# Altium project Layer 1 LW SEN.PrjPcb
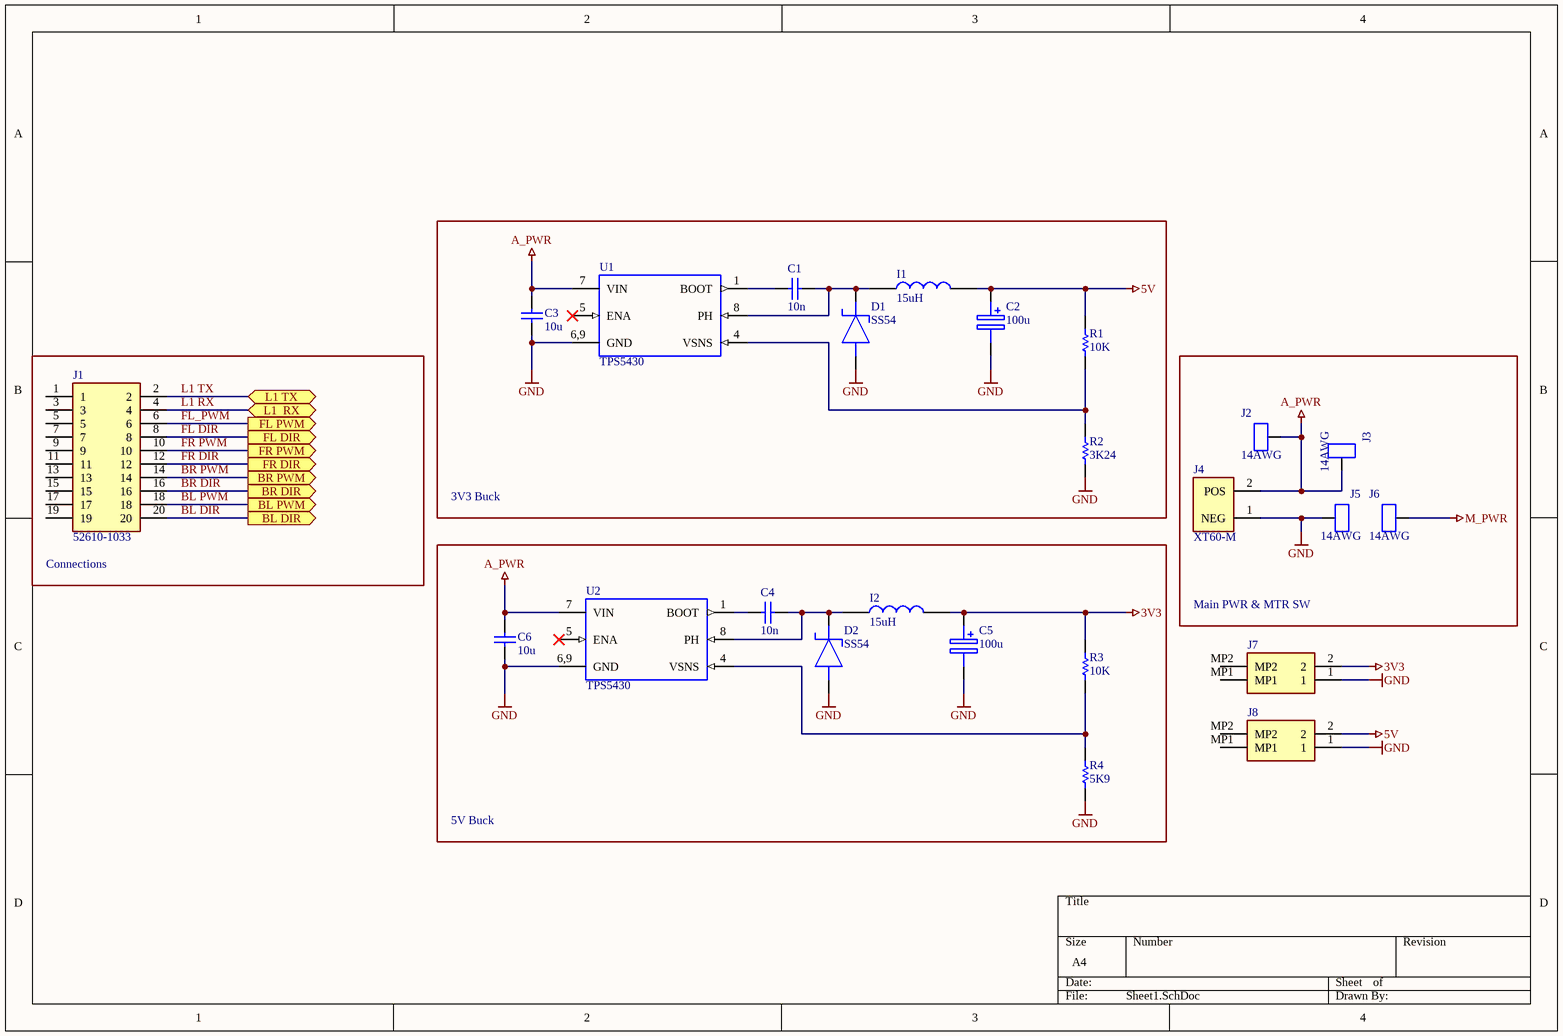
[diagram p0: Sheet1.SchDoc]
3 sheets, 144 parts. Net scope: flat (ports and power ports of the same name join across sheets).
Board file: Sheet1.PcbDoc
Sheets:
  Sheet1.SchDoc
  stm32.SchDoc
  mdriver.SchDoc

## Sheet Sheet1.SchDoc
size A4; SheetNumber: 1; SheetTotal: 4

### Parts
C1  10n  [CAP0603]
C2  100u  [CAP7343]
C3  10u  [CAP0603]
C4  10n  [CAP0603]
C5  100u  [CAP7343]
C6  10u  [CAP0603]
D1  SS54  [SMDSC]
D2  SS54  [SMDSC]
I1  15uH  [SWPA8040]
I2  15uH  [SWPA8040]
J1  52610-1033  [526101033]
J2  14AWG  [14AWG]
J3  14AWG  [14AWG]
J4  XT60-M  [AMASS_XT60-M]
J5  14AWG  [14AWG]
J6  14AWG  [14AWG]
J7  BM02B-SRSS-TB_LF__SN_  [BM02BSRSSTBLFSN]  (value not drawn)
J8  BM02B-SRSS-TB_LF__SN_  [BM02BSRSSTBLFSN]  (value not drawn)
R1  10K  [RES0603]
R2  3K24  [RES0603]
R3  10K  [RES0603]
R4  5K9  [RES0603]
U1  TPS5430  [FP-DDA0008J-MFG]
U2  TPS5430  [FP-DDA0008J-MFG]

### Blocks framed on the sheet
3V3 Buck: C1-C3 D1 I1 R1 R2 U1
Connections: J1
Main PWR & MTR SW: J2-J6
5V Buck: C4-C6 D2 I2 R3 R4 U2

### Ports
BL DIR (out), BL PWM (out), BR DIR (out), BR PWM (out), FL DIR (out), FL PWM (out), FR DIR (out), FR PWM (out), L1  RX (bidir), L1 TX (bidir)

### Nets
3V3: C5.1(+) I2.2 J7.2 R3.1
5V: C2.1(+) I1.2 J8.2 R1.1
A_PWR: C3.2 C6.2 J2.1 J3.1 J4.2(POS) U1.7(VIN) U2.7(VIN)
GND: C2.2(-) C3.1 C5.2(-) C6.1 D1.2(A) D2.2(A) J4.1(NEG) J5.1 J7.1 J8.1 R2.2 R4.2 U1.6,9(GND) U2.6,9(GND)
M_PWR: J6.1
BL DIR: J1.20 ; port BL DIR
BL PWM: J1.18 ; port BL PWM
BR DIR: J1.16 ; port BR DIR
BR PWM: J1.14 ; port BR PWM
FL DIR: J1.8 ; port FL DIR
FL_PWM: J1.6 ; port FL PWM  [project net FL PWM]
FR DIR: J1.12 ; port FR DIR
FR PWM: J1.10 ; port FR PWM
L1 RX: J1.4 ; port L1  RX
L1 TX: J1.2 ; port L1 TX
NetC1_1: C1.1 D1.1(K) I1.1 U1.8(PH)
NetC1_2: C1.2 U1.1(BOOT)
NetC4_1: C4.1 D2.1(K) I2.1 U2.8(PH)
NetC4_2: C4.2 U2.1(BOOT)
NetR1_2: R1.2 R2.1 U1.4(VSNS)
NetR3_2: R3.2 R4.1 U2.4(VSNS)

Not connected (* = marked no-connect by the designer): J1 1 3 5 7 9 11 13 15 17 19; J7 MP1 MP2; J8 MP1 MP2; U1 5(ENA)*; U2 5(ENA)*

### Library data of the parts
C1 C3 C4 C6 = CAP0603: 0603 Capacitor
C2 C5 = EIA7343: 25V 100UF ±20%; Value: 100u
D1 D2 = Schotty Diode: SMD Schotty Diode
I1 I2 = SWPA8040: 10uH INDUCTOR
J1 = 52610-1033: Connector; Manufacturer_Name: Molex; Datasheet Link: https://www.mouser.com/datasheet/2/276/0526101033_FFC_FPC_CONNECTORS-294979.pdf; Height: 7.45mm; Manufacturer_Part_Number: 52610-1033; Mouser Part Number: 538-52610-1033; Mouser Price/Stock: https://www.mouser.co.uk/ProductDetail/Molex/52610-1033?qs=rw2VfpiI%2FsPpjB%252BOP20huA%3D%3D
J4 = CMP-062-000000-4: Plug; DC supply; XT60; male; PIN: 2; for cable; soldered; 30A; 500V; MF: AMASS; SnapEDA_Link: https://www.snapeda.com/parts/XT60-M/AMASS/view-part/2883912/?ref=snap; Design Item ID: XT60-M; Price: None; Availability: Unavailable; Source: SnapEDAsch.SchLib; Component Type: Standard; Package: Package Analog Devices; MP: XT60-M; Pin Count: 2; Value: *
J7 J8 = BM02B-SRSS-TB_LF__SN_: Connector; Manufacturer_Name: JST (JAPAN SOLDERLESS TERMINALS); Manufacturer_Part_Number: BM02B-SRSS-TB(LF)(SN); Datasheet Link: http://www.jst-mfg.com/product/pdf/eng/eSR.pdf; Height: 4.25mm; Arrow Part Number: BM02B-SRSS-TB(LF)(SN); Arrow Price/Stock: https://www.arrow.com/en/products/bm02b-srss-tb-lf-sn/jst-manufacturing?region=europe
R1-R4 = RES0603: Resistor
U1 U2 = TPS5430: TPS5430 3-A, Wide Input Range, Step-Down Converter

## Sheet stm32.SchDoc
size A4; SheetNumber: 2; SheetTotal: 3
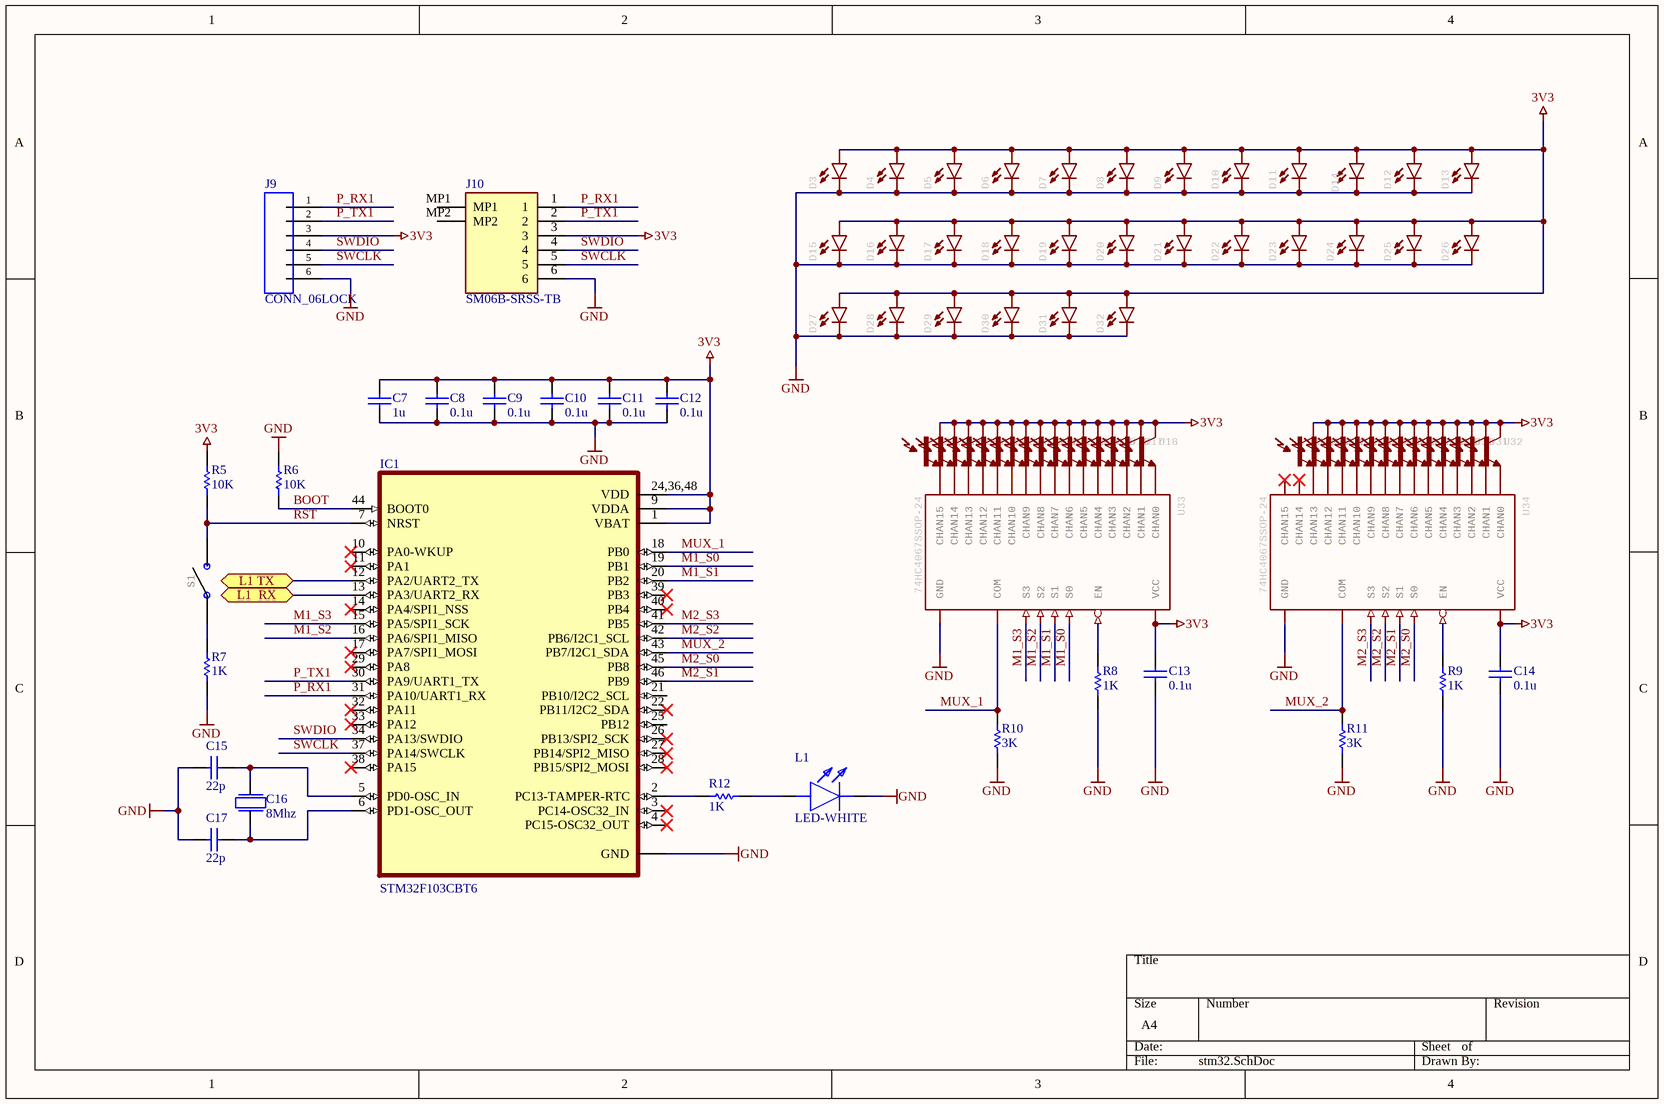
[diagram p1: stm32.SchDoc]

### Parts
C7  1u  [CAP0603]
C8  0.1u  [CAP0603]
C9  0.1u  [CAP0603]
C10  0.1u  [CAP0603]
C11  0.1u  [CAP0603]
C12  0.1u  [CAP0603]
C13  0.1u  [CAP0603]
C14  0.1u  [CAP0603]
C15  22p  [CAP0603]
C16  8Mhz  [CRYSTAL-8MHZ]
C17  22p  [CAP0603]
D3  LED3528  [LED-3528]  (value not drawn)
D4  LED3528  [LED-3528]  (value not drawn)
D5  LED3528  [LED-3528]  (value not drawn)
D6  LED3528  [LED-3528]  (value not drawn)
D7  LED3528  [LED-3528]  (value not drawn)
D8  LED3528  [LED-3528]  (value not drawn)
D9  LED3528  [LED-3528]  (value not drawn)
D10  LED3528  [LED-3528]  (value not drawn)
D11  LED3528  [LED-3528]  (value not drawn)
D12  LED3528  [LED-3528]  (value not drawn)
D13  LED3528  [LED-3528]  (value not drawn)
D14  LED3528  [LED-3528]  (value not drawn)
D15  LED3528  [LED-3528]  (value not drawn)
D16  LED3528  [LED-3528]  (value not drawn)
D17  LED3528  [LED-3528]  (value not drawn)
D18  LED3528  [LED-3528]  (value not drawn)
D19  LED3528  [LED-3528]  (value not drawn)
D20  LED3528  [LED-3528]  (value not drawn)
D21  LED3528  [LED-3528]  (value not drawn)
D22  LED3528  [LED-3528]  (value not drawn)
D23  LED3528  [LED-3528]  (value not drawn)
D24  LED3528  [LED-3528]  (value not drawn)
D25  LED3528  [LED-3528]  (value not drawn)
D26  LED3528  [LED-3528]  (value not drawn)
D27  LED3528  [LED-3528]  (value not drawn)
D28  LED3528  [LED-3528]  (value not drawn)
D29  LED3528  [LED-3528]  (value not drawn)
D30  LED3528  [LED-3528]  (value not drawn)
D31  LED3528  [LED-3528]  (value not drawn)
D32  LED3528  [LED-3528]  (value not drawn)
IC1  STM32F103CBT6  [QFP50P900X900X160-48N]
J9  CONN_06LOCK  [1X06_LOCK]
J10  SM06B-SRSS-TB  [SM06BSRSSTB]
L1  LED-WHITE  [LED0603]
R5  10K  [RES0603]
R6  10K  [RES0603]
R7  1K  [RES0603]
R8  1K  [RES0603]
R9  1K  [RES0603]
R10  3K  [RES0603]
R11  3K  [RES0603]
R12  1K  [RES0603]
S1  Push Botton Switch  [MOMENTARY_SWITCH_4X3]  (value not drawn)
U3  LIGHT_SENSOR_ALS  [ALS-PT19]  (value not drawn)
U4  LIGHT_SENSOR_ALS  [ALS-PT19]  (value not drawn)
U5  LIGHT_SENSOR_ALS  [ALS-PT19]  (value not drawn)
U6  LIGHT_SENSOR_ALS  [ALS-PT19]  (value not drawn)
U7  LIGHT_SENSOR_ALS  [ALS-PT19]  (value not drawn)
U8  LIGHT_SENSOR_ALS  [ALS-PT19]  (value not drawn)
U9  LIGHT_SENSOR_ALS  [ALS-PT19]  (value not drawn)
U10  LIGHT_SENSOR_ALS  [ALS-PT19]  (value not drawn)
U11  LIGHT_SENSOR_ALS  [ALS-PT19]  (value not drawn)
U12  LIGHT_SENSOR_ALS  [ALS-PT19]  (value not drawn)
U13  LIGHT_SENSOR_ALS  [ALS-PT19]  (value not drawn)
U14  LIGHT_SENSOR_ALS  [ALS-PT19]  (value not drawn)
U15  LIGHT_SENSOR_ALS  [ALS-PT19]  (value not drawn)
U16  LIGHT_SENSOR_ALS  [ALS-PT19]  (value not drawn)
U17  LIGHT_SENSOR_ALS  [ALS-PT19]  (value not drawn)
U18  LIGHT_SENSOR_ALS  [ALS-PT19]  (value not drawn)
U19  LIGHT_SENSOR_ALS  [ALS-PT19]  (value not drawn)
U20  LIGHT_SENSOR_ALS  [ALS-PT19]  (value not drawn)
U21  LIGHT_SENSOR_ALS  [ALS-PT19]  (value not drawn)
U22  LIGHT_SENSOR_ALS  [ALS-PT19]  (value not drawn)
U23  LIGHT_SENSOR_ALS  [ALS-PT19]  (value not drawn)
U24  LIGHT_SENSOR_ALS  [ALS-PT19]  (value not drawn)
U25  LIGHT_SENSOR_ALS  [ALS-PT19]  (value not drawn)
U26  LIGHT_SENSOR_ALS  [ALS-PT19]  (value not drawn)
U27  LIGHT_SENSOR_ALS  [ALS-PT19]  (value not drawn)
U28  LIGHT_SENSOR_ALS  [ALS-PT19]  (value not drawn)
U29  LIGHT_SENSOR_ALS  [ALS-PT19]  (value not drawn)
U30  LIGHT_SENSOR_ALS  [ALS-PT19]  (value not drawn)
U31  LIGHT_SENSOR_ALS  [ALS-PT19]  (value not drawn)
U32  LIGHT_SENSOR_ALS  [ALS-PT19]  (value not drawn)
U33  74HC4067SSOP-24  [SSOP24]
U34  74HC4067SSOP-24  [SSOP24]

### Ports
L1  RX (bidir), L1 TX (bidir)

### Nets
3V3: C7.2 C8.2 C9.2 C10.2 C11.2 C12.2 C13.2 C14.2 D3.1(A) D4.1(A) D5.1(A) D6.1(A) D7.1(A) D8.1(A) D9.1(A) D10.1(A) D11.1(A) D12.1(A) D13.1(A) D14.1(A) D15.1(A) D16.1(A) D17.1(A) D18.1(A) D19.1(A) D20.1(A) D21.1(A) D22.1(A) D23.1(A) D24.1(A) D25.1(A) D26.1(A) D27.1(A) D28.1(A) D29.1(A) D30.1(A) D31.1(A) D32.1(A) IC1.1(VBAT) IC1.9(VDDA) IC1.24,36,48(VDD) J9.3 J10.3 R5.2 U3.1(C1) U4.1(C1) U5.1(C1) U6.1(C1) U7.1(C1) U8.1(C1) U9.1(C1) U10.1(C1) U11.1(C1) U12.1(C1) U13.1(C1) U14.1(C1) U15.1(C1) U16.1(C1) U17.1(C1) U18.1(C1) U19.1(C1) U20.1(C1) U21.1(C1) U22.1(C1) U23.1(C1) U24.1(C1) U25.1(C1) U26.1(C1) U27.1(C1) U28.1(C1) U29.1(C1) U30.1(C1) U31.1(C1) U32.1(C1) U33.24(VCC) U34.24(VCC)
GND: C7.1 C8.1 C9.1 C10.1 C11.1 C12.1 C13.1 C14.1 C15.1 C17.1 D3.2(C) D4.2(C) D5.2(C) D6.2(C) D7.2(C) D8.2(C) D9.2(C) D10.2(C) D11.2(C) D12.2(C) D13.2(C) D14.2(C) D15.2(C) D16.2(C) D17.2(C) D18.2(C) D19.2(C) D20.2(C) D21.2(C) D22.2(C) D23.2(C) D24.2(C) D25.2(C) D26.2(C) D27.2(C) D28.2(C) D29.2(C) D30.2(C) D31.2(C) D32.2(C) IC1.8,23,35,47(GND) J9.6 J10.6 L1.1(K) R6.2 R7.1 R8.1 R9.1 R10.1 R11.1 U33.12(GND) U34.12(GND)
BOOT: IC1.44(BOOT0) R6.1
L1 RX: IC1.13(PA3/UART2_RX) ; port L1  RX
L1 TX: IC1.12(PA2/UART2_TX) ; port L1 TX
M1_S0: IC1.19(PB1) U33.10(S0)
M1_S1: IC1.20(PB2) U33.11(S1)
M1_S2: IC1.16(PA6/SPI1_MISO) U33.14(S2)
M1_S3: IC1.15(PA5/SPI1_SCK) U33.13(S3)
M2_S0: IC1.45(PB8) U34.10(S0)
M2_S1: IC1.46(PB9) U34.11(S1)
M2_S2: IC1.42(PB6/I2C1_SCL) U34.14(S2)
M2_S3: IC1.41(PB5) U34.13(S3)
MUX_1: IC1.18(PB0) R10.2 U33.1(COM)
MUX_2: IC1.43(PB7/I2C1_SDA) R11.2 U34.1(COM)
P_RX1: IC1.31(PA10/UART1_RX) J9.1 J10.1
P_TX1: IC1.30(PA9/UART1_TX) J9.2 J10.2
RST: IC1.7(NRST) R5.1 S1.2
SWCLK: IC1.37(PA14/SWCLK) J9.5 J10.5
SWDIO: IC1.34(PA13/SWDIO) J9.4 J10.4
NetC15_2: C15.2 C16.2 IC1.5(PD0-OSC_IN)
NetC16_1: C16.1 C17.2 IC1.6(PD1-OSC_OUT)
NetIC1_2: IC1.2(PC13-TAMPER-RTC) R12.2
NetL1_2: L1.2(A) R12.1
NetR7_2: R7.2 S1.1
NetR8_2: R8.2 U33.15(EN)
NetR9_2: R9.2 U34.15(EN)
NetU3_2: U3.2(E1) U33.16(CHAN15)
NetU4_2: U4.2(E1) U33.17(CHAN14)
NetU5_2: U5.2(E1) U33.18(CHAN13)
NetU6_2: U6.2(E1) U33.19(CHAN12)
NetU7_2: U7.2(E1) U33.20(CHAN11)
NetU8_2: U8.2(E1) U33.21(CHAN10)
NetU9_2: U9.2(E1) U33.22(CHAN9)
NetU10_2: U10.2(E1) U33.23(CHAN8)
NetU11_2: U11.2(E1) U33.2(CHAN7)
NetU12_2: U12.2(E1) U33.3(CHAN6)
NetU13_2: U13.2(E1) U33.4(CHAN5)
NetU14_2: U14.2(E1) U33.5(CHAN4)
NetU15_2: U15.2(E1) U33.6(CHAN3)
NetU16_2: U16.2(E1) U33.7(CHAN2)
NetU17_2: U17.2(E1) U33.8(CHAN1)
NetU18_2: U18.2(E1) U33.9(CHAN0)
NetU19_2: U19.2(E1) U34.18(CHAN13)
NetU20_2: U20.2(E1) U34.19(CHAN12)
NetU21_2: U21.2(E1) U34.20(CHAN11)
NetU22_2: U22.2(E1) U34.21(CHAN10)
NetU23_2: U23.2(E1) U34.22(CHAN9)
NetU24_2: U24.2(E1) U34.23(CHAN8)
NetU25_2: U25.2(E1) U34.2(CHAN7)
NetU26_2: U26.2(E1) U34.3(CHAN6)
NetU27_2: U27.2(E1) U34.4(CHAN5)
NetU28_2: U28.2(E1) U34.5(CHAN4)
NetU29_2: U29.2(E1) U34.6(CHAN3)
NetU30_2: U30.2(E1) U34.7(CHAN2)
NetU31_2: U31.2(E1) U34.8(CHAN1)
NetU32_2: U32.2(E1) U34.9(CHAN0)

Not connected (* = marked no-connect by the designer): IC1 3(PC14-OSC32_IN)* 4(PC15-OSC32_OUT)* 10(PA0-WKUP)* 11(PA1)* 14(PA4/SPI1_NSS)* 17(PA7/SPI1_MOSI)* 21(PB10/I2C2_SCL) 22(PB11/I2C2_SDA)* 25(PB12) 26(PB13/SPI2_SCK)* 27(PB14/SPI2_MISO)* 28(PB15/SPI2_MOSI)* 29(PA8)* 32(PA11)* 33(PA12)* 38(PA15)* 39(PB3)* 40(PB4)*; J10 MP1 MP2; U34 16(CHAN15)* 17(CHAN14)*

### Library data of the parts
C7-C15 C17 = CAP0603: 0603 Capacitor
C16 = Crystal: 8/16Mhz
D3-D32 = CMP-066-000002-5: 3528-LED; SymbolName_1: LED-1; DeviceName: 3528; GateName_1: G$1; DeviceSetName: LED; Component Type: Standard; LibraryName: JH; Package: LED-3528; Pin Count: 2; Design Item ID: LED3528; Source: JH.SCHLIB
IC1 = STM32F103CBT6: ARMÂ® CortexÂ®-M3 STM32F1 Microcontroller IC 32-Bit 72MHz 128KB _128K x 8_ FLASH; Manufacturer_Name: STMicroelectronics; Datasheet Link: http://www.st.com/st-web-ui/static/active/en/resource/technical/document/datasheet/CD00161566.pdf; Height: 1.6mm; Manufacturer_Part_Number: STM32F103CBT6; Mouser Part Number: 511-STM32F103CBT6; Mouser Price/Stock: https://www.mouser.co.uk/ProductDetail/STMicroelectronics/STM32F103CBT6?qs=WxFF5lh7QM3goh6GV5Ogig%3D%3D; Arrow Part Number: STM32F103CBT6; Arrow Price/Stock: https://www.arrow.com/en/products/stm32f103cbt6/stmicroelectronics?region=europe
J10 = SM06B-SRSS-TB: Connector; Manufacturer_Name: JST (JAPAN SOLDERLESS TERMINALS); Datasheet Link: https://media.digikey.com/pdf/Data%20Sheets/JST%20PDFs/SR%20Connector.pdf; Height: 2.95mm; Manufacturer_Part_Number: SM06B-SRSS-TB
L1 = LED-0603
R5-R12 = RES0603: Resistor
U3-U32 = CMP-071-000008-4: Photo Resistor; DeviceName: _ALS; SymbolName_1: LIGHTSENSOR; GateName_1: G$1; LibraryName: JH; Pin Count: 2; DeviceSetName: LIGHT_SENSOR; Component Type: Standard; Package: ALS-PT19; Design Item ID: LIGHT_SENSOR_ALS; Source: JH.SCHLIB
U33 U34 = CMP-071-000007-3: 16 Channel Analog MUX; GateName_1: G$1; Source: JH.SCHLIB; DeviceSetName: 74HC4067; Pin Count: 24; LibraryName: JH; Package: SSOP24; SymbolName_1: 74HC4067; Component Type: Standard; DeviceName: SSOP-24; Design Item ID: 74HC4067SSOP-24

## Sheet mdriver.SchDoc: VNH5050 Motor Driver Circuit
size A4; ApprovedBy: Vincent Cayadi; CheckedBy: Vincent Cayadi; Author: Vincent Cayadi; CompanyName: Hwa Chong Institution; DrawnBy: Vincent Cayadi; Engineer: Vincent Cayadi; Organization: Sentinels Robotics; SheetNumber: 3; SheetTotal: 3
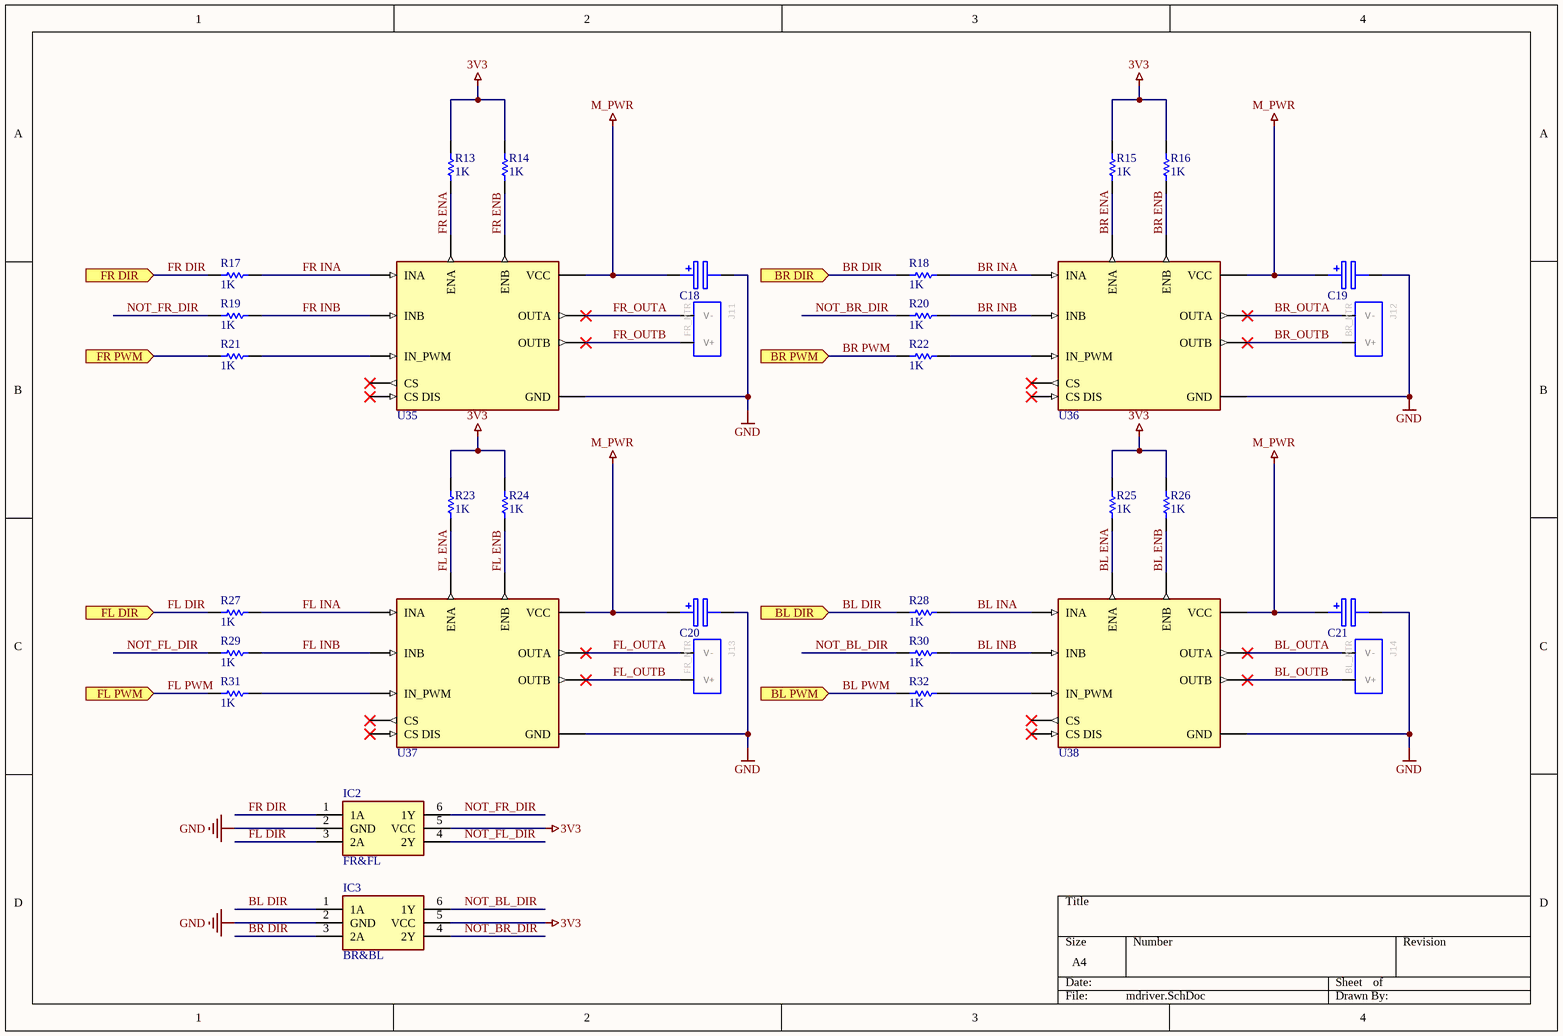
[diagram p2: mdriver.SchDoc]

### Parts
C18  47u  [EEE0JA331XP]  (value not drawn)
C19  47u  [EEE0JA331XP]  (value not drawn)
C20  47u  [EEE0JA331XP]  (value not drawn)
C21  47u  [EEE0JA331XP]  (value not drawn)
IC2  FR&FL  [SOT-23-6]
IC3  BR&BL  [SOT-23-6]
J11  FR_MTR  [XT30PB-F]
J12  BR_MTR  [XT30PB-F]
J13  FR_MTR  [XT30PB-F]
J14  BL_MTR  [XT30PB-F]
R13  1K  [RES0603]
R14  1K  [RES0603]
R15  1K  [RES0603]
R16  1K  [RES0603]
R17  1K  [RES0603]
R18  1K  [RES0603]
R19  1K  [RES0603]
R20  1K  [RES0603]
R21  1K  [RES0603]
R22  1K  [RES0603]
R23  1K  [RES0603]
R24  1K  [RES0603]
R25  1K  [RES0603]
R26  1K  [RES0603]
R27  1K  [RES0603]
R28  1K  [RES0603]
R29  1K  [RES0603]
R30  1K  [RES0603]
R31  1K  [RES0603]
R32  1K  [RES0603]
U35  FR  [SOP50P1030X247-39N]  (value not drawn)
U36  BR  [SOP50P1030X247-39N]  (value not drawn)
U37  FL  [SOP50P1030X247-39N]  (value not drawn)
U38  BL  [SOP50P1030X247-39N]  (value not drawn)

### Ports
BL DIR (in), BL PWM (in), BR DIR (in), BR PWM (in), FL DIR (in), FL PWM (in), FR DIR (in), FR PWM (in)

### Nets
3V3: IC2.5(VCC) IC3.5(VCC) R13.2 R14.2 R15.2 R16.2 R23.2 R24.2 R25.2 R26.2
GND: C18.2(-) C19.2(-) C20.2(-) C21.2(-) IC2.2(GND) IC3.2(GND) U35.GND U36.GND U37.GND U38.GND
M_PWR: C18.1(+) C19.1(+) C20.1(+) C21.1(+) U35.39(VCC) U36.39(VCC) U37.39(VCC) U38.39(VCC)
BL DIR: IC3.1(1A) R28.2 ; port BL DIR
BL ENA: R25.1 U38.16(ENA)
BL ENB: R26.1 U38.21(ENB)
BL INA: R28.1 U38.15(INA)
BL INB: R30.1 U38.22(INB)
BL PWM: R32.2 ; port BL PWM
BL_OUTA: J14.-(V-) U38.38(OUTA)
BL_OUTB: J14.+(V+) U38.37(OUTB)
BR DIR: IC3.3(2A) R18.2 ; port BR DIR
BR ENA: R15.1 U36.16(ENA)
BR ENB: R16.1 U36.21(ENB)
BR INA: R18.1 U36.15(INA)
BR INB: R20.1 U36.22(INB)
BR PWM: R22.2 ; port BR PWM
BR_OUTA: J12.-(V-) U36.38(OUTA)
BR_OUTB: J12.+(V+) U36.37(OUTB)
FL DIR: IC2.3(2A) R27.2 ; port FL DIR
FL ENA: R23.1 U37.16(ENA)
FL ENB: R24.1 U37.21(ENB)
FL INA: R27.1 U37.15(INA)
FL INB: R29.1 U37.22(INB)
FL PWM: R31.2 ; port FL PWM
FL_OUTA: J13.-(V-) U37.38(OUTA)
FL_OUTB: J13.+(V+) U37.37(OUTB)
FR DIR: IC2.1(1A) R17.2 ; port FR DIR
FR ENA: R13.1 U35.16(ENA)
FR ENB: R14.1 U35.21(ENB)
FR INA: R17.1 U35.15(INA)
FR INB: R19.1 U35.22(INB)
FR PWM: R21.2 ; port FR PWM
FR_OUTA: J11.-(V-) U35.38(OUTA)
FR_OUTB: J11.+(V+) U35.37(OUTB)
NOT_BL_DIR: IC3.6(1Y) R30.2
NOT_BR_DIR: IC3.4(2Y) R20.2
NOT_FL_DIR: IC2.4(2Y) R29.2
NOT_FR_DIR: IC2.6(1Y) R19.2
NetR21_1: R21.1 U35.17(IN_PWM)
NetR22_1: R22.1 U36.17(IN_PWM)
NetR31_1: R31.1 U37.17(IN_PWM)
NetR32_1: R32.1 U38.17(IN_PWM)

Not connected (* = marked no-connect by the designer): U35 CS* CS DIS*; U36 CS* CS DIS*; U37 CS* CS DIS*; U38 CS* CS DIS*

### Library data of the parts
C18-C21 = CMP-092-000001-4: Cap Aluminum Lytic 47uF 50V 20% (6.3 X 7.7mm) SMD 63mA 2000h 105C Automotive T/R; Manufacturer_Name: Panasonic; Height: 7.8mm; Mouser Part Number: 667-EEE-HBH470YAP; Arrow Part Number: EEE-HBH470YAP; Datasheet Link: http://industrial.panasonic.com/cdbs/www-data/pdf/RDE0000/ABA0000C1154.pdf; Manufacturer_Part_Number: EEE-HBH470YAP; Arrow Price/Stock: https://www.arrow.com/en/products/eee-hbh470yap/panasonic; Design Item ID: EEE-HBH470YAP; Source: SamacSys.SchLib; Mouser Price/Stock: https://www.mouser.com/Search/Refine.aspx?Keyword=667-EEE-HBH470YAP
IC2 IC3 = SN74LVC2G04DRLR: Integrated Circuit; Manufacturer_Name: Texas Instruments; Height: 0.6mm; Mouser Part Number: 595-SN74LVC2G04DRLR; Manufacturer_Part_Number: SN74LVC2G04DRLR; Datasheet Link: http://www.ti.com/lit/gpn/sn74lvc2g04; Mouser Price/Stock: https://www.mouser.co.uk/ProductDetail/Texas-Instruments/SN74LVC2G04DRLR?qs=pajgIaoyDUgGT9cUBVgEUw%3D%3D; Arrow Price/Stock: https://www.arrow.com/en/products/sn74lvc2g04drlr/texas-instruments?region=nac; Arrow Part Number: SN74LVC2G04DRLR
J11-J14 = XT30PB-F
R13-R32 = RES0603: Resistor
U35-U38 = VNH5050A-E: Motor Driver Power MOSFET Parallel, PWM PowerSSO-36; MF: STMicroelectronics; Availability: Unavailable; Source: SnapEDAsch.SchLib; Price: None; Value: *; Component Type: Standard; Pin Count: 62; MP: VNH5050A-E; SnapEDA_Link: https://www.snapeda.com/parts/VNH5050A-E/STMicroelectronics/view-part/490583/?ref=snap; Design Item ID: VNH5050A-E; Package: BFSOP-36 STMicroelectronics

## Nets that join several sheets
3V3: Sheet1 (C5.1 I2.2 J7.2 R3.1), stm32 (76 pins), mdriver (10 pins)
GND: Sheet1 (14 pins), stm32 (52 pins), mdriver (10 pins)
M_PWR: Sheet1 (J6.1), mdriver (8 pins)
BL DIR: Sheet1 (J1.20), mdriver (IC3.1 R28.2)
BL PWM: Sheet1 (J1.18), mdriver (R32.2)
BR DIR: Sheet1 (J1.16), mdriver (IC3.3 R18.2)
BR PWM: Sheet1 (J1.14), mdriver (R22.2)
FL DIR: Sheet1 (J1.8), mdriver (IC2.3 R27.2)
FL PWM: Sheet1 (J1.6), mdriver (R31.2)
FR DIR: Sheet1 (J1.12), mdriver (IC2.1 R17.2)
FR PWM: Sheet1 (J1.10), mdriver (R21.2)
L1 RX: Sheet1 (J1.4), stm32 (IC1.13)
L1 TX: Sheet1 (J1.2), stm32 (IC1.12)